# Altium schematic sheet Power.SchDoc
size A4; SheetNumber: 10; SheetTotal: 11
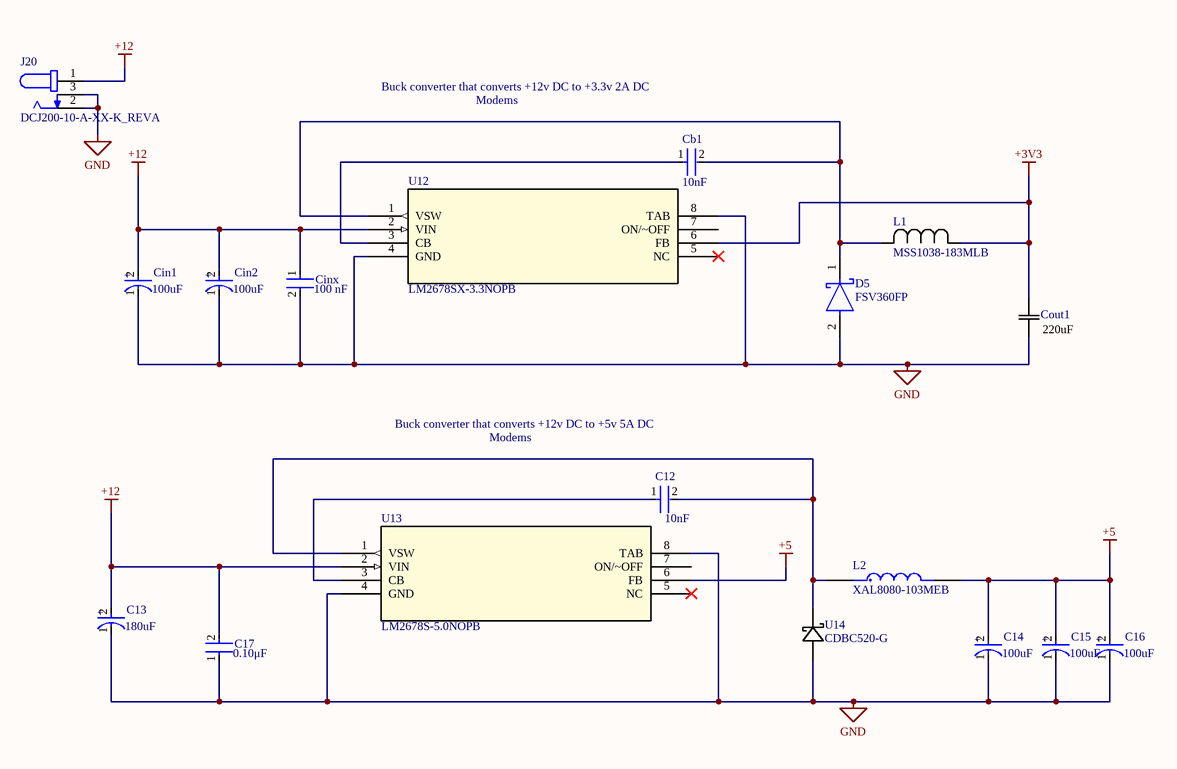
[diagram p0: Power.SchDoc]

## Parts
C12  Capacitance: 10nF  [FP-CGA4J-IPC_B]  (hidden comment: CGA4C2C0G1H103J060AA)
C13  Capacitance: 180uF  [FP-OS-CON-SMT-E7-MFG]  (hidden comment: 20SVPF180M)
C14  Capacitance: 100uF  [FP-POSCAP-B2-MFG]  (hidden comment: 8TPE100MAZB)
C15  Capacitance: 100uF  [FP-POSCAP-B2-MFG]  (hidden comment: 8TPE100MAZB)
C16  Capacitance: 100uF  [FP-POSCAP-B2-MFG]  (hidden comment: 8TPE100MAZB)
C17  Capacitance: 0.10μF  [FP-GRM15-MFG]  (hidden comment: GRM155R71C104KA88D)
Cb1  Capacitance: 10nF  [FP-CGA4J-IPC_B]  (hidden comment: CGA4C2C0G1H103J060AA)
Cin1  Capacitance: 100uF  [FP-FKF-MFG]  (hidden comment: EEE-FK1V101P)
Cin2  Capacitance: 100uF  [FP-FKF-MFG]  (hidden comment: EEE-FK1V101P)
Cinx  value 100 nF  [FP-CC0805-0_85-MFG]  (hidden comment: CC0805KRX7R8BB104)
Cout1  value 220uF  [CHEMI-F61]  (hidden comment: APXF6R3ARA221MF61G)
D5  FSV360FP  [FP-425AC-MFG]
J20  DCJ200-10-A-XX-K_REVA  [GCT_DCJ200-10-A-XX-K_REVA]
L1  MSS1038-183MLB  [IND_MSS1038_COC]
L2  XAL8080-103MEB  [IND_XAL8080-103MEB]
U12  LM2678SX-3.3NOPB  [TS7B]
U13  LM2678S-5.0NOPB  [TS7B]
U14  CDBC520-G  [CDBC-G]

## Nets
+3V3: Cout1.2 L1.1 U12.6(FB)
+5: C14.2(A) C15.2(A) C16.2(A) L2.2 U13.6(FB)
+12: C13.2(A) C17.2 Cin1.2(A) Cin2.2(A) Cinx.1 J20.1 U12.2(VIN) U13.2(VIN)
GND: C13.1(C) C14.1(C) C15.1(C) C16.1(C) C17.1 Cin1.1(C) Cin2.1(C) Cinx.2 Cout1.1 D5.2(A) J20.2 J20.3 U12.4(GND) U12.8(TAB) U13.4(GND) U13.8(TAB) U14.2
NetC12_1: C12.1 U13.3(CB)
NetC12_2: C12.2 L2.1 U13.1(VSW) U14.1
NetCb1_1: Cb1.1 U12.3(CB)
NetCb1_2: Cb1.2 D5.1(C) L1.2 U12.1(VSW)

Not connected (* = marked no-connect by the designer): U12 5(NC)* 7(ON/~OFF); U13 5(NC)* 7(ON/~OFF)

## Notes on the sheet
- Buck converter that converts +12v DC to +3.3v 2A DC
- Modems
- Buck converter that converts +12v DC to +5v 5A DC
- (in symbol CMP-05427-000084-1) +
- (in symbol CMP-05428-001015-1) +
- (in symbol CMP-05428-001341-1) +

## Library data of the parts
C12 Cb1 = CMP-08246-000595-1: Cap Ceramic 10nF 50V C0G 5% Pad SMD 0805 +125°C Automotive T/R; Max Operating Temperature: 125°C; Voltage Rating (DC): 50V; Packaging: Tape and Reel; Composition: Ceramic; Case/Package: 0805; REACH SVHC: No SVHC; Dielectric: C0G; Depth: 1.25mm; Min Operating Temperature: -55°C; Termination: SMD/SMT; Length: 2mm; Case Code (Metric): 2012; Thickness: 0.028inch; Ratings: AEC-Q200; Package Quantity: 1; Case Code (Imperial): 0805; Tolerance: 5%; Voltage Rating: 50V; Radiation Hardening: No; Lead Free: Lead Free; Height: 0.6mm; Mount: Surface Mount; Weight: 0.000194oz; Width: 0.049inch
C13 = CMP-05428-001015-1: Conductive Polymer Aluminum Solid Capacitors (OS-CON) 180uF ±20% 20V RADIAL SMT 8x6.9mm; Polarity: Polar; Life (Hours): 5000Hour; Leakage Current: 720uA; Dissipation Factor: 12%; Ripple Current (AC): 3.2A; ESR (Equivalent Series Resistance): 25mR; Voltage: 20V; Height: 6.9mm; Length: 6.9mm; Number of Pins: 7; Packaging: Tape and Reel; Mount: Surface Mount; Lead Free: Lead Free; Max Operating Temperature: 105°C; Voltage Rating: 20V; Construction: Cylindrical; REACH SVHC: No SVHC; Diameter: 8mm; Tolerance: 20%; Package Quantity: 1000; Voltage Rating (DC): 20V; Series: OS-CON™, SVPF; Termination: SMD/SMT; Min Operating Temperature: -55°C; Ripple Current: 3.2A; RoHS Compliant: Yes; Case/Package: Radial; Height - Seated (Max): 0.276inch
C14-C16 = CMP-05428-001341-1: Molded Tantalum Polymer Capacitor 100uF 20% 8V life 1000Hours SMD 1411; Ripple Current: 1.4A; Polarity: Polar; ESR (Equivalent Series Resistance): 35mR; Leakage Current: 80uA; Dissipation Factor: 8%; Number of Pins: 2; Mount: Surface Mount; Lead Free: Lead Free; Min Operating Temperature: -55°C; Height - Seated (Max): 0.079inch; Tolerance: 20%; Voltage Rating (DC): 8V; Series: POSCAP™ TPE; RoHS Compliant: Yes; Features: General Purpose; Length: 3.5mm; Depth: 2.8mm; Termination: SMD/SMT; Height: 1.9mm; Radiation Hardening: No; Width: 2.8mm; Voltage Rating: 8V; Construction: Flat; Case/Package: Molded; Package Quantity: 2000; Voltage: 8V; Max Operating Temperature: 105°C; Case Code (Imperial): 1210; Case Code (Metric): 3528; Packaging: Tape and Reel; REACH SVHC: No SVHC
C17 = CMP-2100-03641-2: CAP CER 0.1UF 16V X7R 0402; Manufacturer: Murata; Standoff Height: 0mm; Tolerance: 10%; Voltage Rating: 16Vdc; Material: Ceramic; Value: 0.10μF; RoHS: TRUE; Manufacturer Part Number: GRM155R71C104KA88D; Temperature Characteristic: X7R; Octopart: https://octopart.com/grm155r71c104ka88d-murata-196880; Digikey Description: CAP CER 0.1UF 16V X7R 0402; Device Class L3: Ceramic Capacitors; Height: 0.55mm; ComponentLink2Description: Datasheet; Temperature Range Low: -55°C; Ipc Land Pattern Name: CAPC10050X219; ComponentLink2URL: https://search.murata.co.jp/Ceramy/image/img/A01X/G101/ENG/GRM155R71H471KA01-01A.pdf; Device Class L1: Passive Components; Lead Free: yes; Category: Cap; Package: GRM15; Temperature: -55°C to +125°C; Device Class L2: Capacitors; Temperature Range High: +125°C; Mouser Description: 0402 0.1 uF 16V ±10 % Tolerance X7R SMT Multilayer Ceramic Capacitor
Cin1 Cin2 = CMP-05427-000084-1: CAP ALUM 100UF 20% 35V SMD; Leakage Current: 3uA; ESR (Equivalent Series Resistance): 160mR; Ripple Current (AC): 600mA; Life (Hours): 2000Hour; Dielectric Material: Aluminium; RoHS Compliant: Yes; Construction: Cylindrical; REACH SVHC: No SVHC; Width: 10mm; Min Operating Temperature: -55°C; Voltage Rating (DC): 35V; Voltage: 35V; Impedance: 160mR; Ripple Current: 600mA; Lead Free: Lead Free; Packaging: Tape and Reel; Radiation Hardening: No; Mount: Surface Mount; Termination: SMD/SMT; Max Operating Temperature: 105°C; Package Quantity: 1; Length: 10.2mm; Contact Plating: Tin; Case/Package: Radial; Series: FK; Number of Pins: 2; Tolerance: 20%; Voltage Rating: 35V; Diameter: 8mm; Height: 10.2mm; Height - Seated (Max): 0.402inch
Cinx = CMP-1036-04410-2: CAP CER 0.1UF 25V X7R 0805; Manufacturer: Yageo; Tolerance: 0.1; ComponentLink2URL: http://www.yageo.com/documents/recent/UPY-GPHC_Y5V_6.3V-to-50V_8.pdf; Category: Cap; Mouser Description: Multilayer Ceramic Capacitors MLCC - SMD/SMT 100nF 25V X7R 10%; Manufacturer Part Number: CC0805KRX7R8BB104; Device Class L1: Passive Components; Footprint Url: http://www.yageo.com/exep/pages/download/literatures/UPY-C_GEN_24.pdf; Height: 0.95mm; Material: Ceramic; Digikey Description: CAP CER 0.1UF 25V X7R 0805; Lead Free: Yes; Temperature Range High: +85°C; Temperature: -30°C to +85°C; Ipc Land Pattern Name: CAPC200125X85; Capacitance: 100 nF; Automotive: No; Octopart: https://octopart.com/cc0805krx7r8bb104-yageo-39467766; Device Class L2: Capacitors; Temperature Characteristic: X7R; Voltage Rating: 25 V; ComponentLink2Description: Datasheet; Temperature Range Low: -30°C; Device Class L3: Ceramic Capacitors; RoHS: TRUE; Package: CC0805-0.85; Parameter 1: *
Cout1 = APXF6R3ARA221MF61G: No Description Available; Mfr_Name: Nippon Chemi-Con
D5 = CMP-07162-000017-1: DIODE SCHOTTKY 60V 3A SOD123HE; Manufacturer: ON Semiconductor; Peak Reverse Current: 100uA; Max Surge Forward Current: 80A; Max Junction Temp: +150°C; ComponentLink2URL: https://www.onsemi.jp/PowerSolutions/document/FSV360FP-D.PDF; Device Class L1: Discrete Semiconductors; RoHS: TRUE; Temperature: -55°C to +150°C; ComponentLink2Description: Datasheet; Manufacturer Part Number: FSV360FP; Height: 1mm; Octopart: https://octopart.com/fsv360fp-on+semiconductor-84328668; Device Class L2: Diodes; Forward Current: 3A; Automotive: No; Device Class L3: Schottky Diodes; Reverse Voltage: 60V; Digikey Description: DIODE SCHOTTKY 60V 3A SOD123HE; Footprint Url: https://www.onsemi.com/pub/Collateral/425AC.PDF; Package: 425AC; Mouser Description: 60V 3A Schottky Barrier Rectifier in SOD-123HE / TAPE REEL; Max Repetitive Reverse Voltage: 60V; Category: Diode; Lead Free: Yes; Temperature Range High: +150°C; Temperature Range Low: -55°C
J20 = DCJ200-10-A-XX-K_REVA: Power Barrel Connector Jack 2.05mm ID (0.081), 5.50mm OD (0.217) Through Hole, Right Angle; MF: Global Connector Technology; MP: DCJ200-10-A-K1-K; SnapEDA_Link: https://www.snapeda.com/parts/DCJ200-10-A-K1-K/Global+Connector+Technology/view-part/?ref=snap; Package: None; Value: *; Check_prices: https://www.snapeda.com/parts/DCJ200-10-A-K1-K/Global+Connector+Technology/view-part/?ref=eda
L1 = MSS1038-183MLB: No Description Available; Mfr_Name: Coilcraft
U12 = LM2678SX-3.3NOPB: No Description Available; Mfr_Name: Texas Instruments; Type: LM2678S-12; RefDes: RefDes
U13 = LM2678S-5.0NOPB: No Description Available; Mfr_Name: Texas Instruments; Type: LM2678S-12; RefDes: RefDes
U14 = CDBC520-G: No Description Available; Mfr_Name: Comchip
L2 = XAL8080-103MEB: Value: *; Availability: Unavailable; Price: None; MP: XAL8080-103MEB; Package: None